# Altium schematic sheet RS232 Comms.SchDoc: RB25DET - RS232 Comms
size A4; Address1: Drawn By:; Address2: Dan Visser; DocumentNumber: A; Revision: 0.1; SheetNumber: 4; SheetTotal: 14
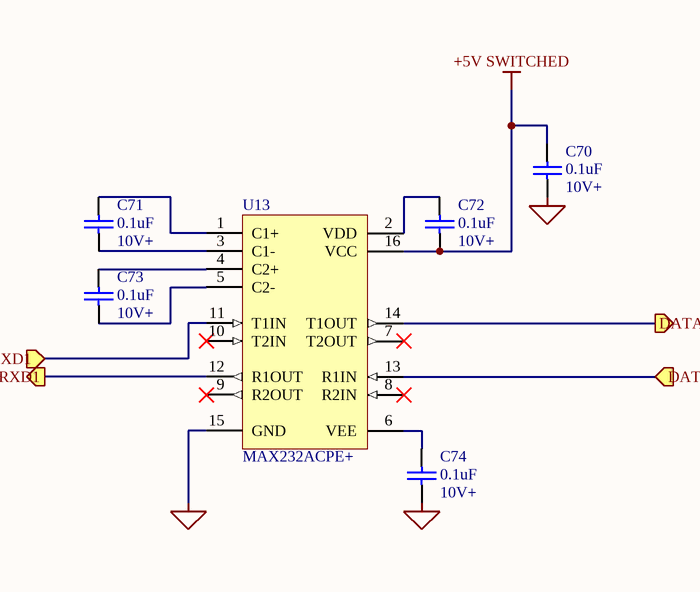
[diagram p0: RS232 Comms.SchDoc]

## Parts
C70  value 0.1uF  [RAD-0.3]
C71  value 0.1uF  [RAD-0.3]
C72  value 0.1uF  [RAD-0.3]
C73  value 0.1uF  [RAD-0.3]
C74  value 0.1uF  [RAD-0.3]
U13  MAX232ACPE+  [WSO16_N]

## Ports
CPU RXD1 (out), CPU TXD1 (in), DATA IN (in), DATA OUT (out)

## Nets
+5V SWITCHED: C70.2 C72.1 U13.16(VCC)
NetC70_1: C70.1 C74.1 U13.15(GND)
CPU RXD1: U13.12(R1OUT) ; port CPU RXD1
CPU TXD1: U13.11(T1IN) ; port CPU TXD1
DATA IN: U13.13(R1IN) ; port DATA IN
DATA OUT: U13.14(T1OUT) ; port DATA OUT
NetC71_1: C71.1 U13.3(C1-)
NetC71_2: C71.2 U13.1(C1+)
NetC72_2: C72.2 U13.2(VDD)
NetC73_1: C73.1 U13.5(C2-)
NetC73_2: C73.2 U13.4(C2+)
NetC74_2: C74.2 U13.6(VEE)

Not connected (* = marked no-connect by the designer): U13 7(T2OUT)* 8(R2IN)* 9(R2OUT)* 10(T2IN)*

## Notes on the sheet
- (near C70) 10V+
- (near C71) 10V+
- (near C72) 10V+
- (near C73) 10V+
- (near C74) 10V+
- Title
- Size:
- Date:
- A4
- Number:
- Time:
- Revision:
- Sheet
- of

## Library data of the parts
C70-C74 = Cap: Capacitor; Published: 8-Jun-2000; LatestRevisionDate: 17-Jul-2002; LatestRevisionNote: Re-released for DXP Platform.; PackageReference: RAD-0.3; Publisher: Altium Limited; PackageDescription: Radial Cap, Thru-Hole; 2 Leads; 0.3 in Pin Spacing
U13 = MAX232ACWE: +5V Powered, Multi-Channel RS-232 Driver/Receiver; Published: 16-Jan-2001; LatestRevisionDate: 13-Apr-2006; LatestRevisionNote: IPC-7351 Footprint Added.; PackageReference: WSO16; Publisher: Altium Limited; PackageDescription: 16-Pin Small Outline Integrated Circuit 1.27 mm Pitch; Code_JEDEC: MS-013-AA; Code_IPC: SOIC127P1030-16; ComponentLink1Description: Manufacturer Link; ComponentLink1URL: http://www.maxim-ic.com/; ComponentLink2Description: Datasheet; ComponentLink2URL: http://pdfserv.maxim-ic.com/en/ds/MAX220-MAX249.pdf